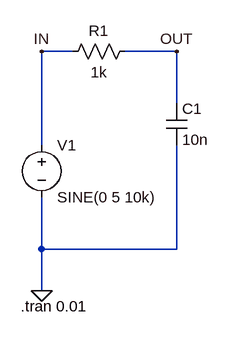
[diagram p0: schematic RC low filter.asc]
RC low filter.asc, the LTspice schematic file:
Version 4
SHEET 1 880 680
WIRE -544 -16 -592 -16
WIRE -384 -16 -464 -16
WIRE -384 64 -384 -16
WIRE -592 128 -592 -16
WIRE -592 288 -592 208
WIRE -384 288 -384 128
WIRE -384 288 -592 288
WIRE -592 352 -592 288
FLAG -592 352 0
FLAG -592 -16 IN
FLAG -384 -16 OUT
SYMBOL res -448 -32 R90
WINDOW 0 0 56 VBottom 2
WINDOW 3 32 56 VTop 2
SYMATTR InstName R1
SYMATTR Value 1k
SYMBOL cap -400 64 R0
SYMATTR InstName C1
SYMATTR Value 10n
SYMBOL voltage -592 112 R0
WINDOW 123 0 0 Left 0
WINDOW 39 0 0 Left 0
SYMATTR InstName V1
SYMATTR Value SINE(0 5 10k)
TEXT -624 376 Left 2 !.tran 0.01

The netlist it stands for:
* RC low filter.asc
R1 OUT IN 1k
C1 OUT 0 10n
V1 IN 0 SINE(0 5 10k)
.tran 0.01
.backanno
.end